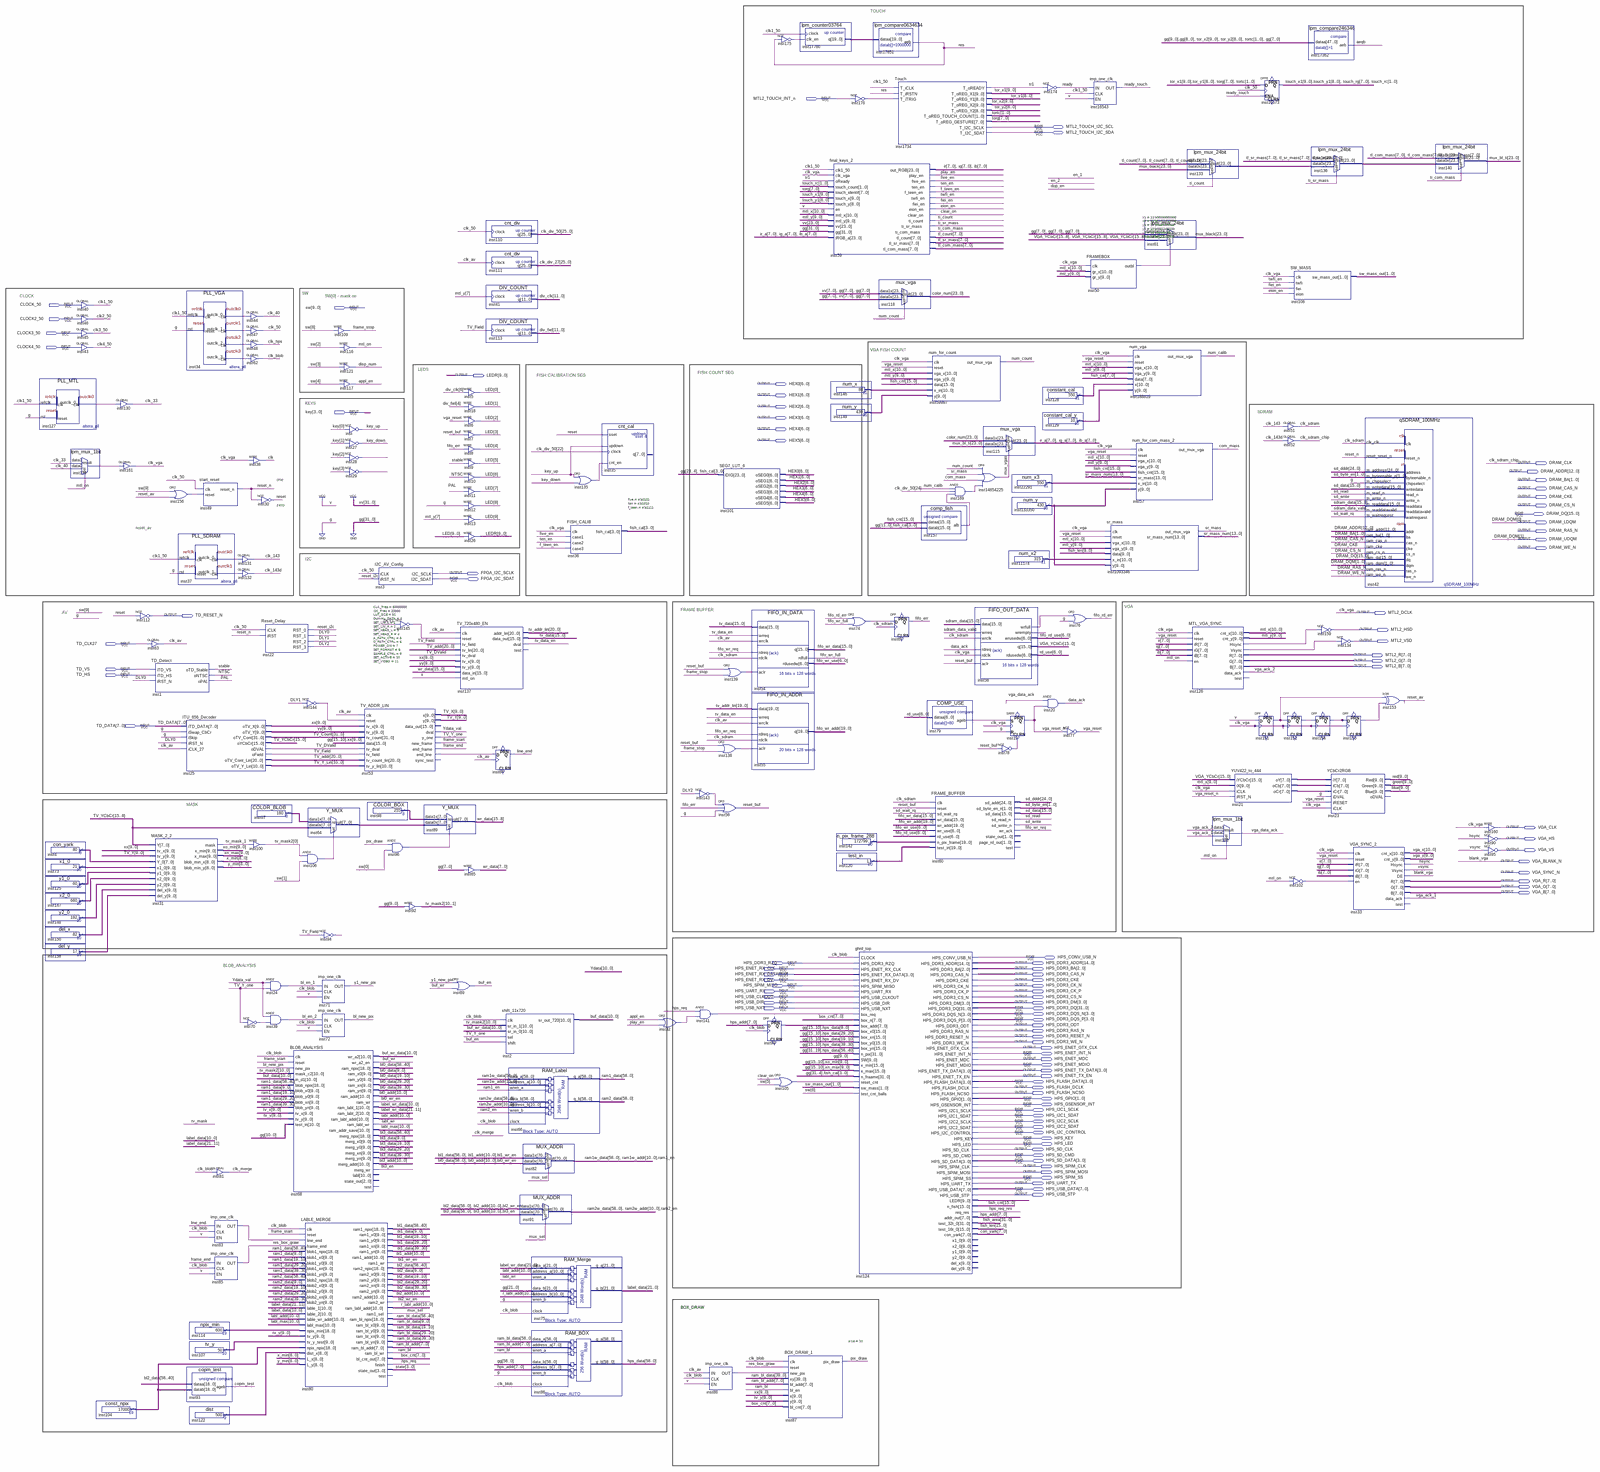
[diagram p0: schematic sheet, whole]
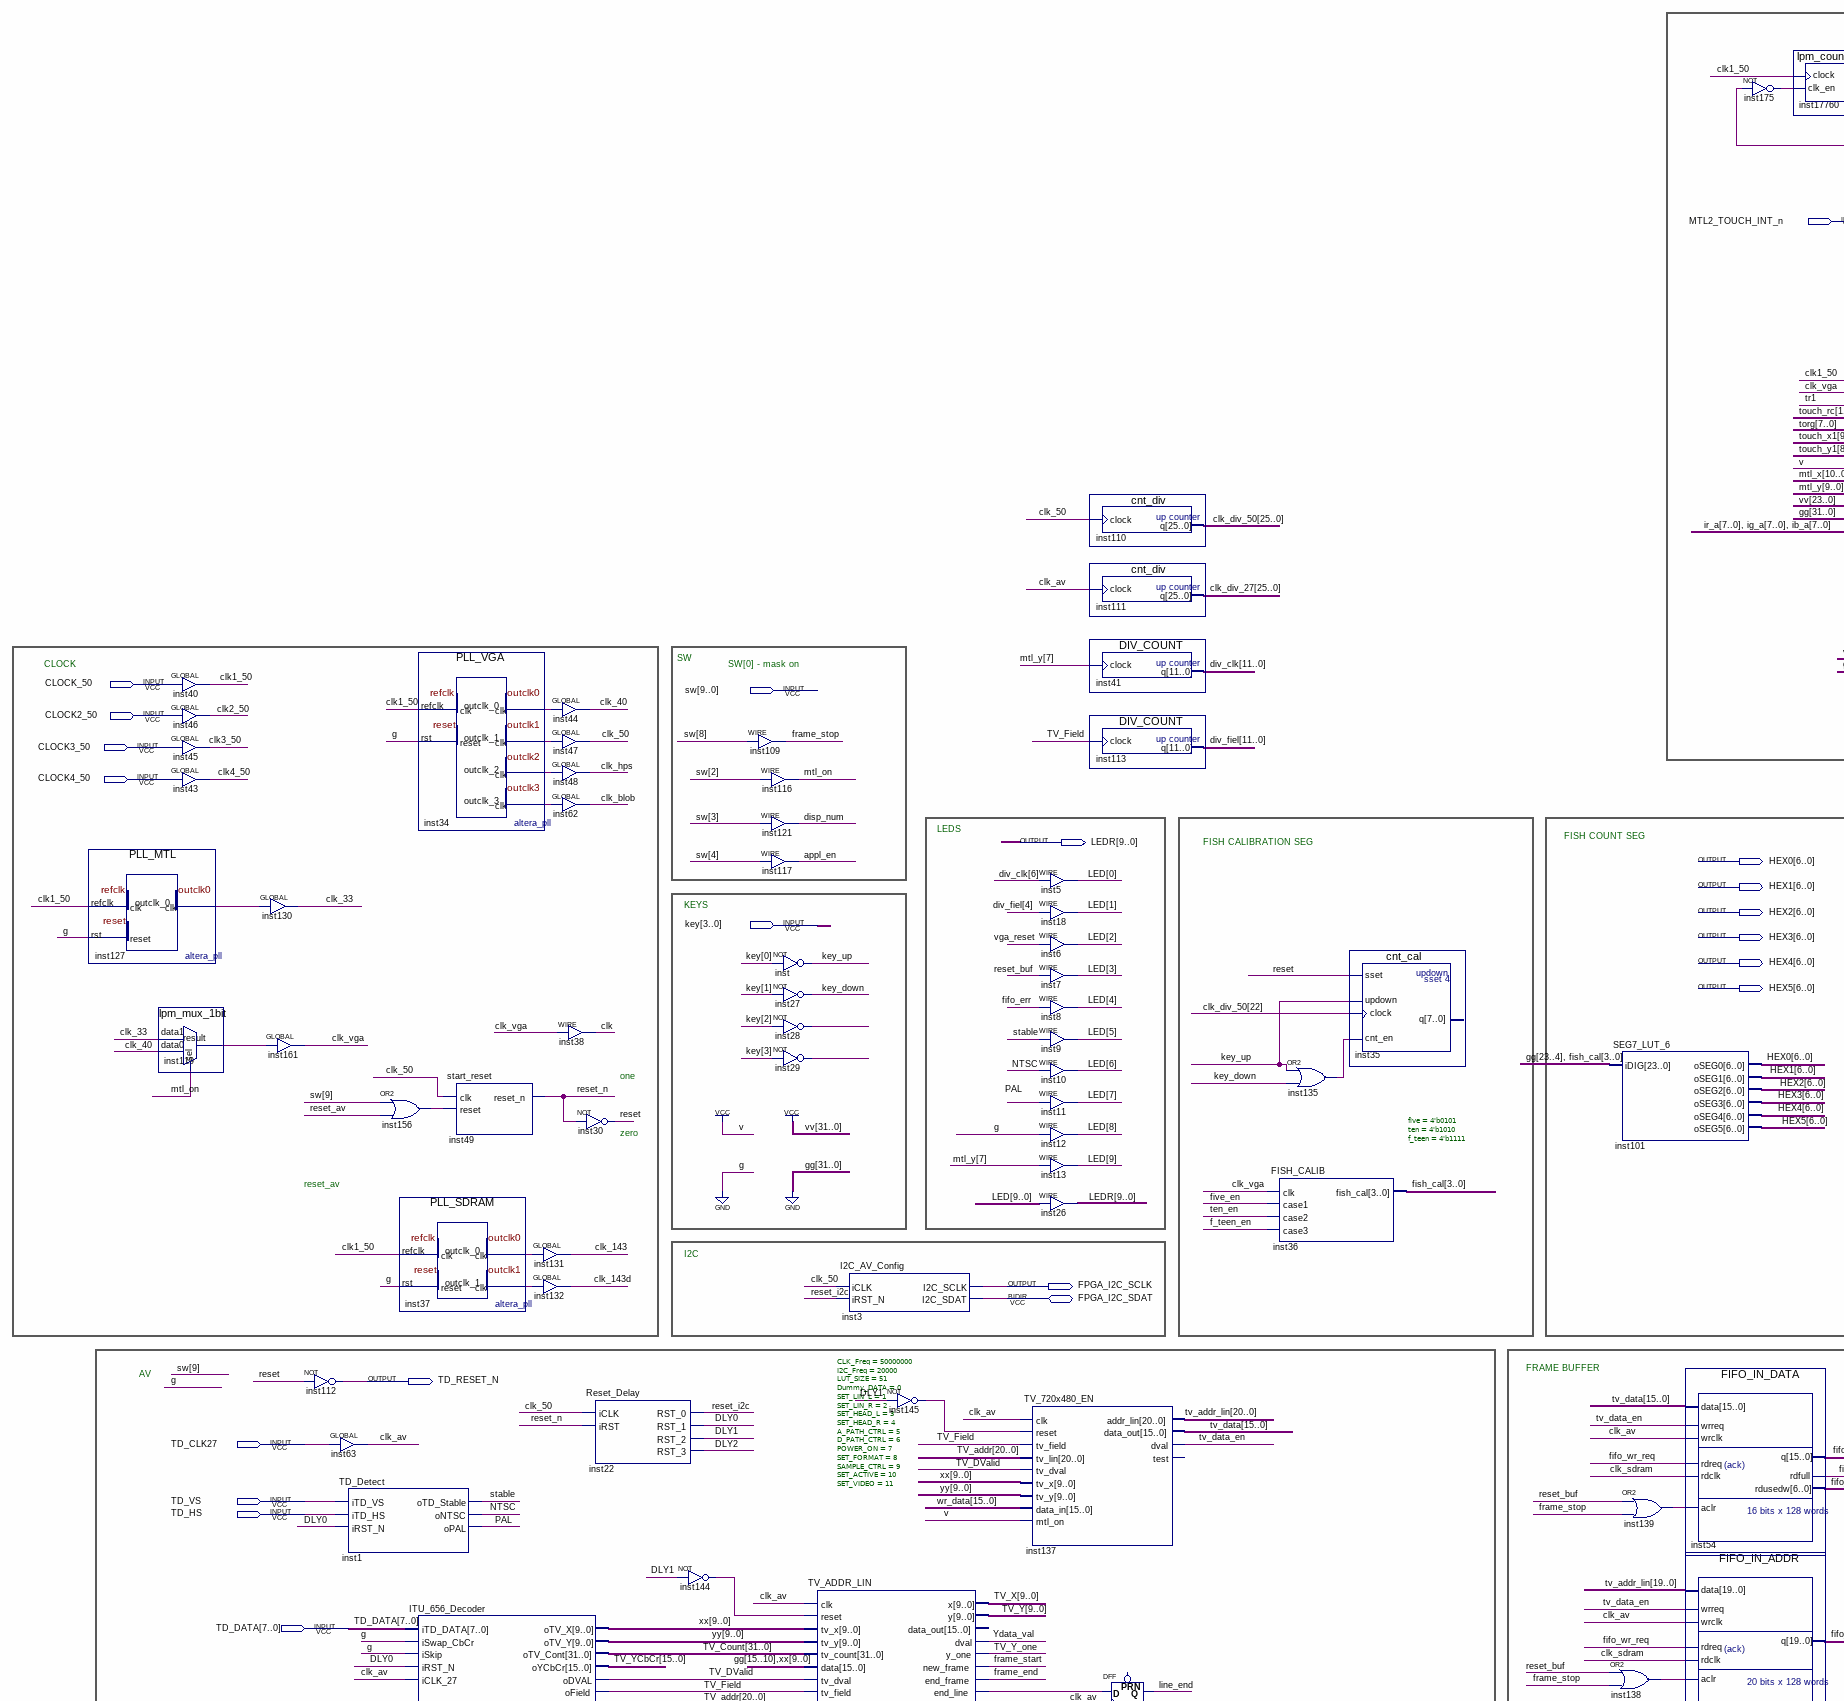
[diagram p1: schematic sheet, upper left part]
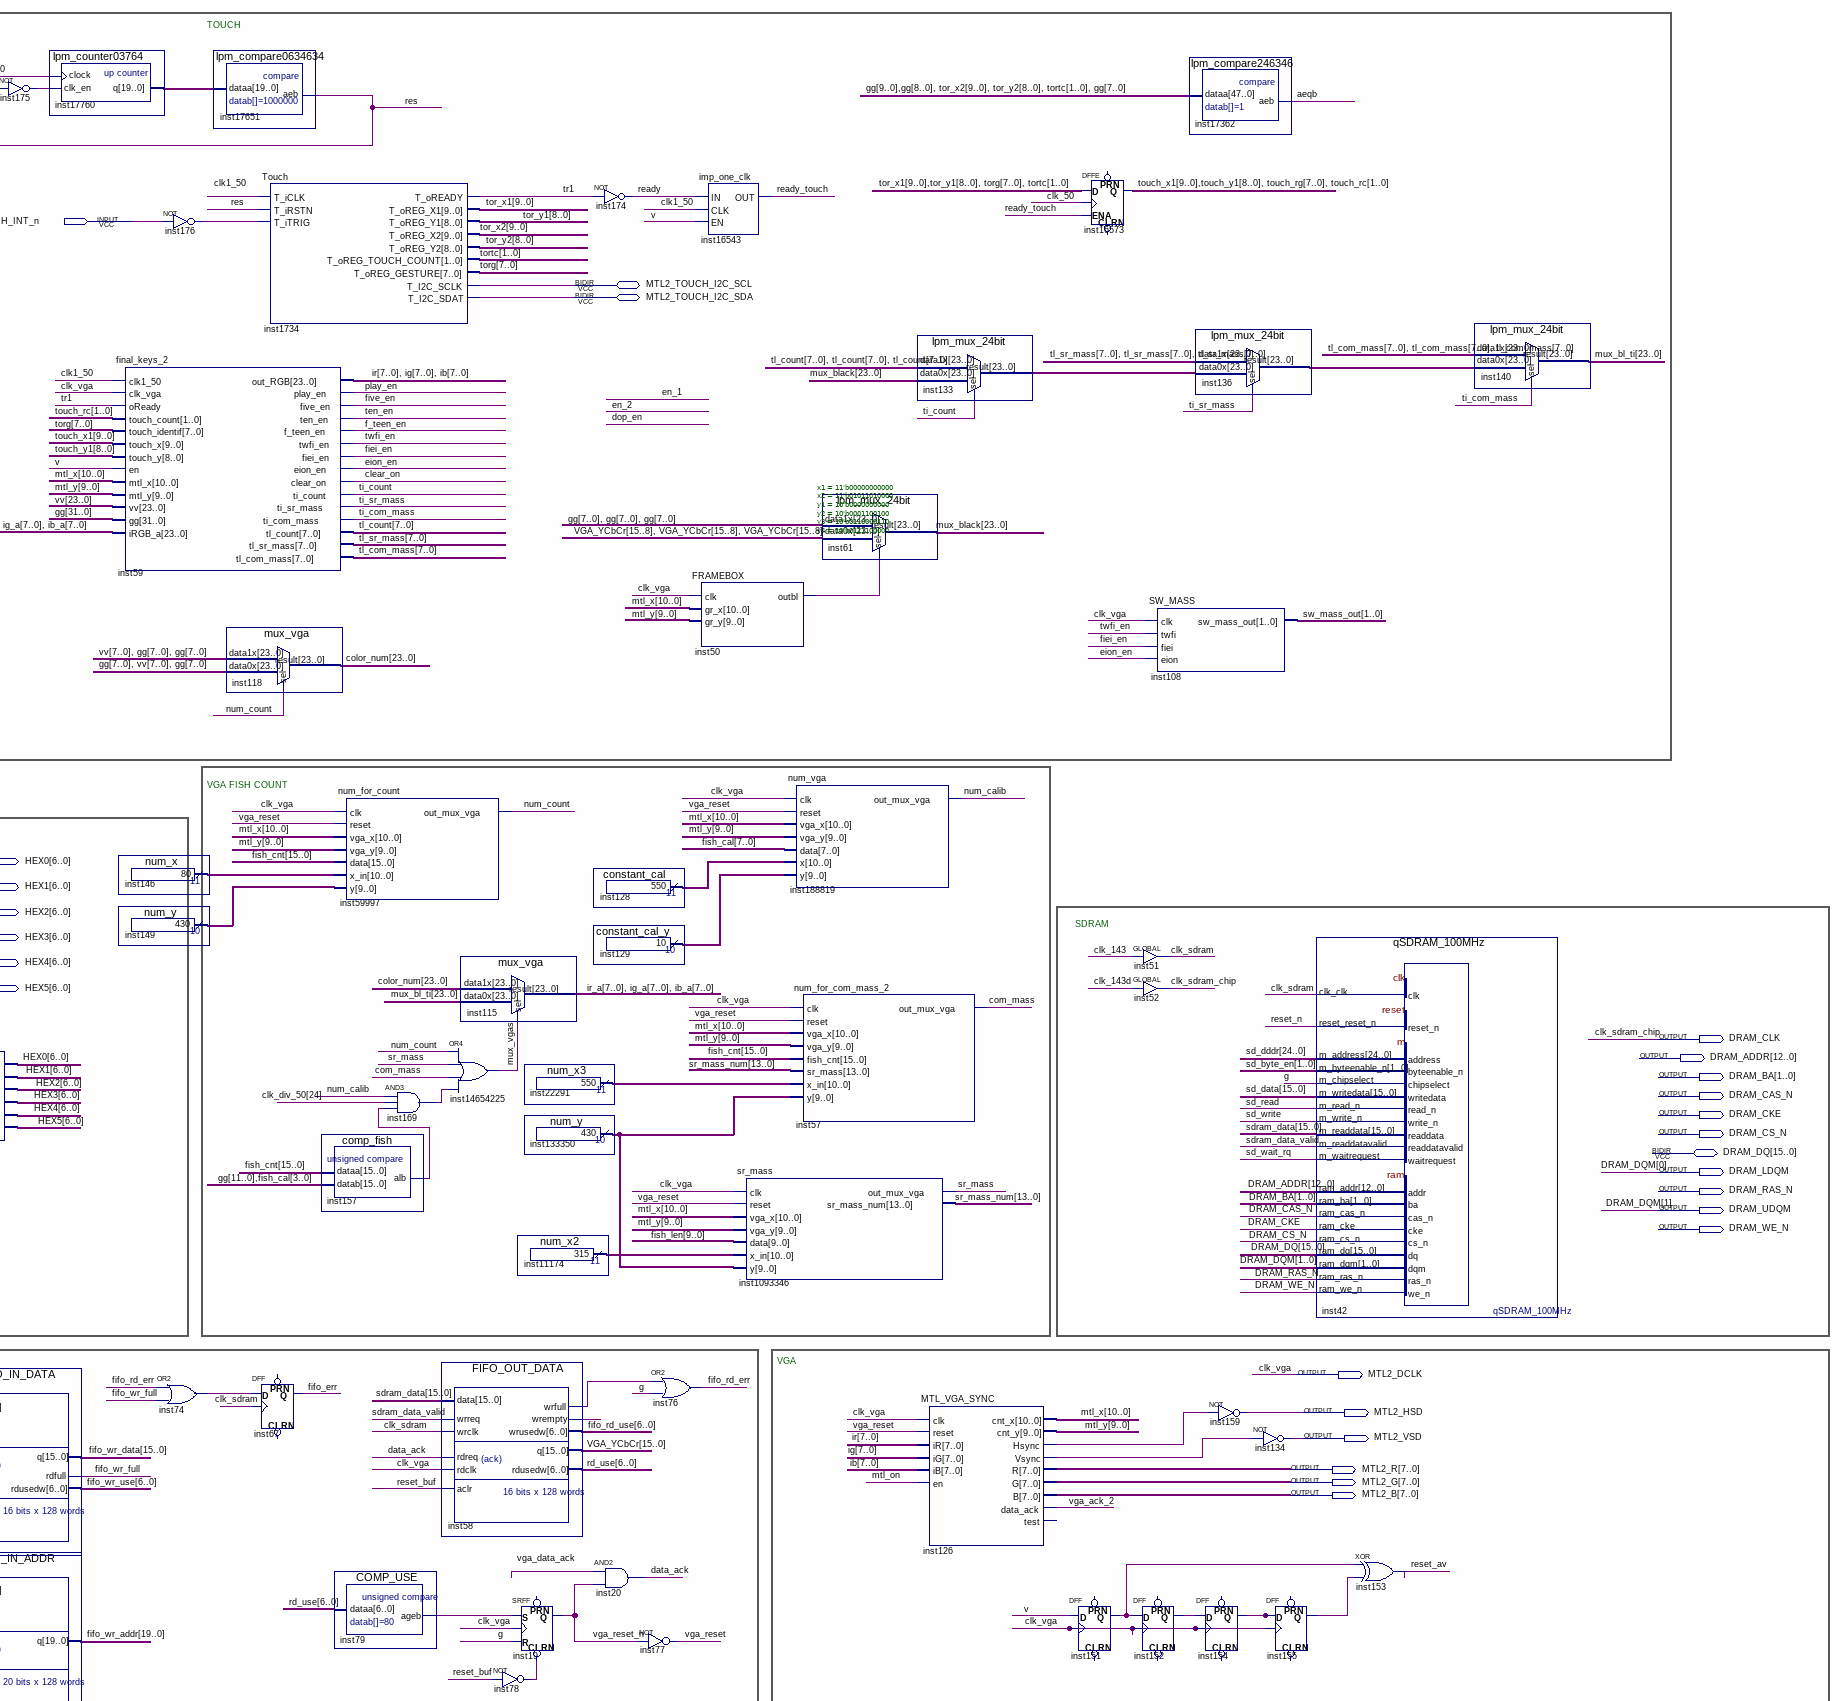
[diagram p2: schematic sheet, upper right part]
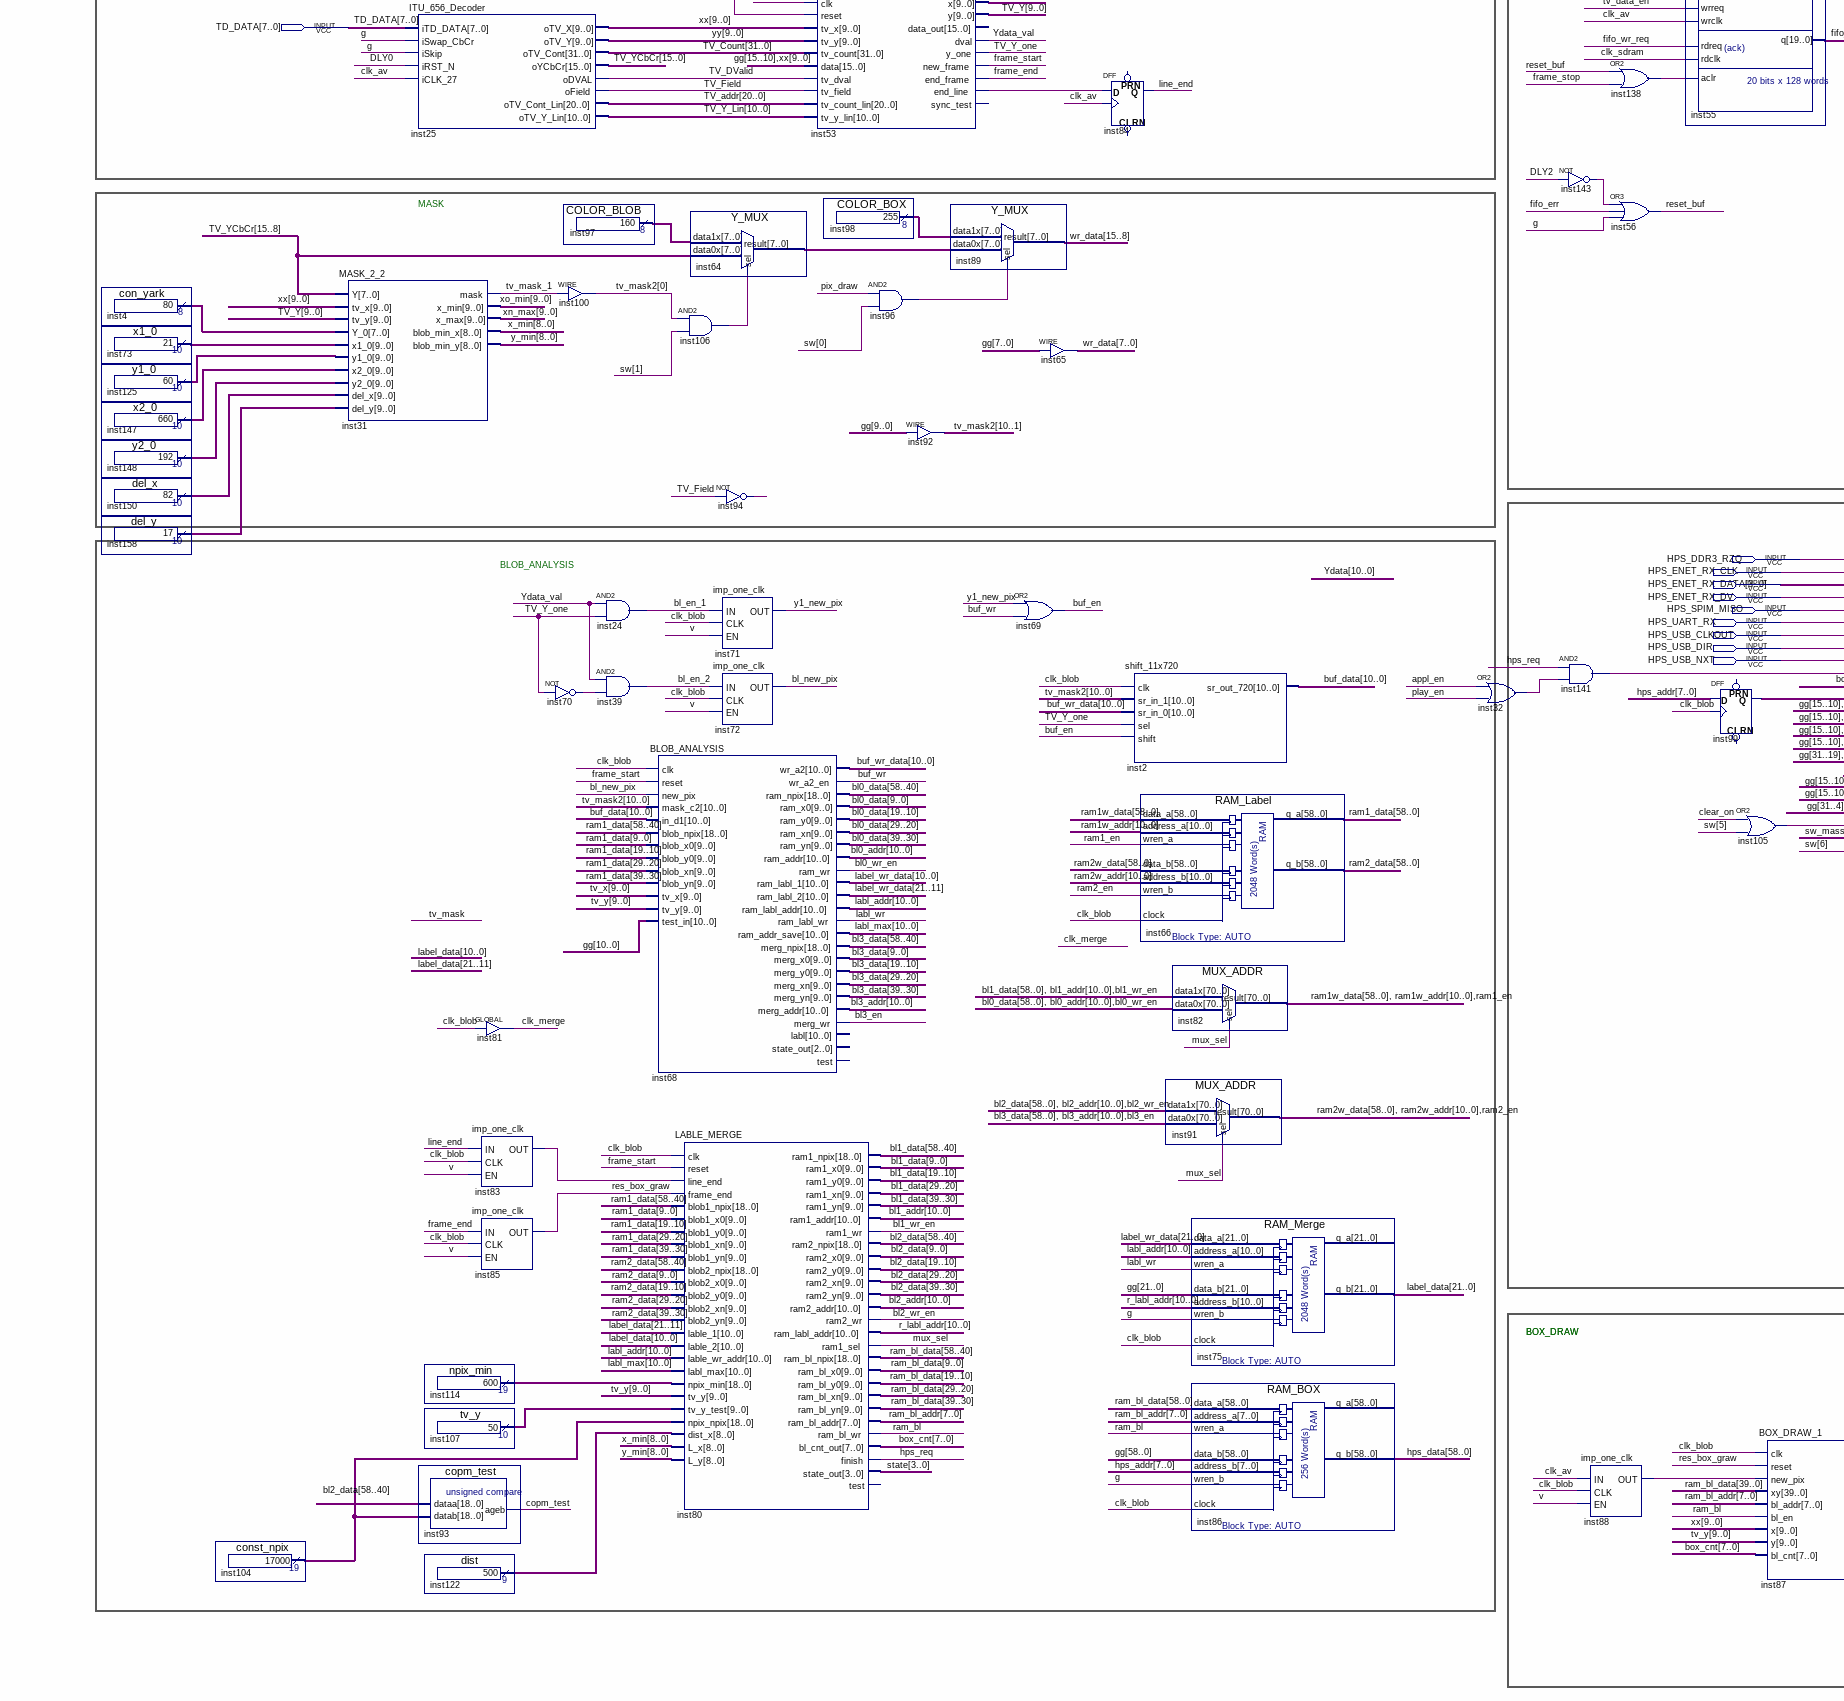
[diagram p3: schematic sheet, lower left part]
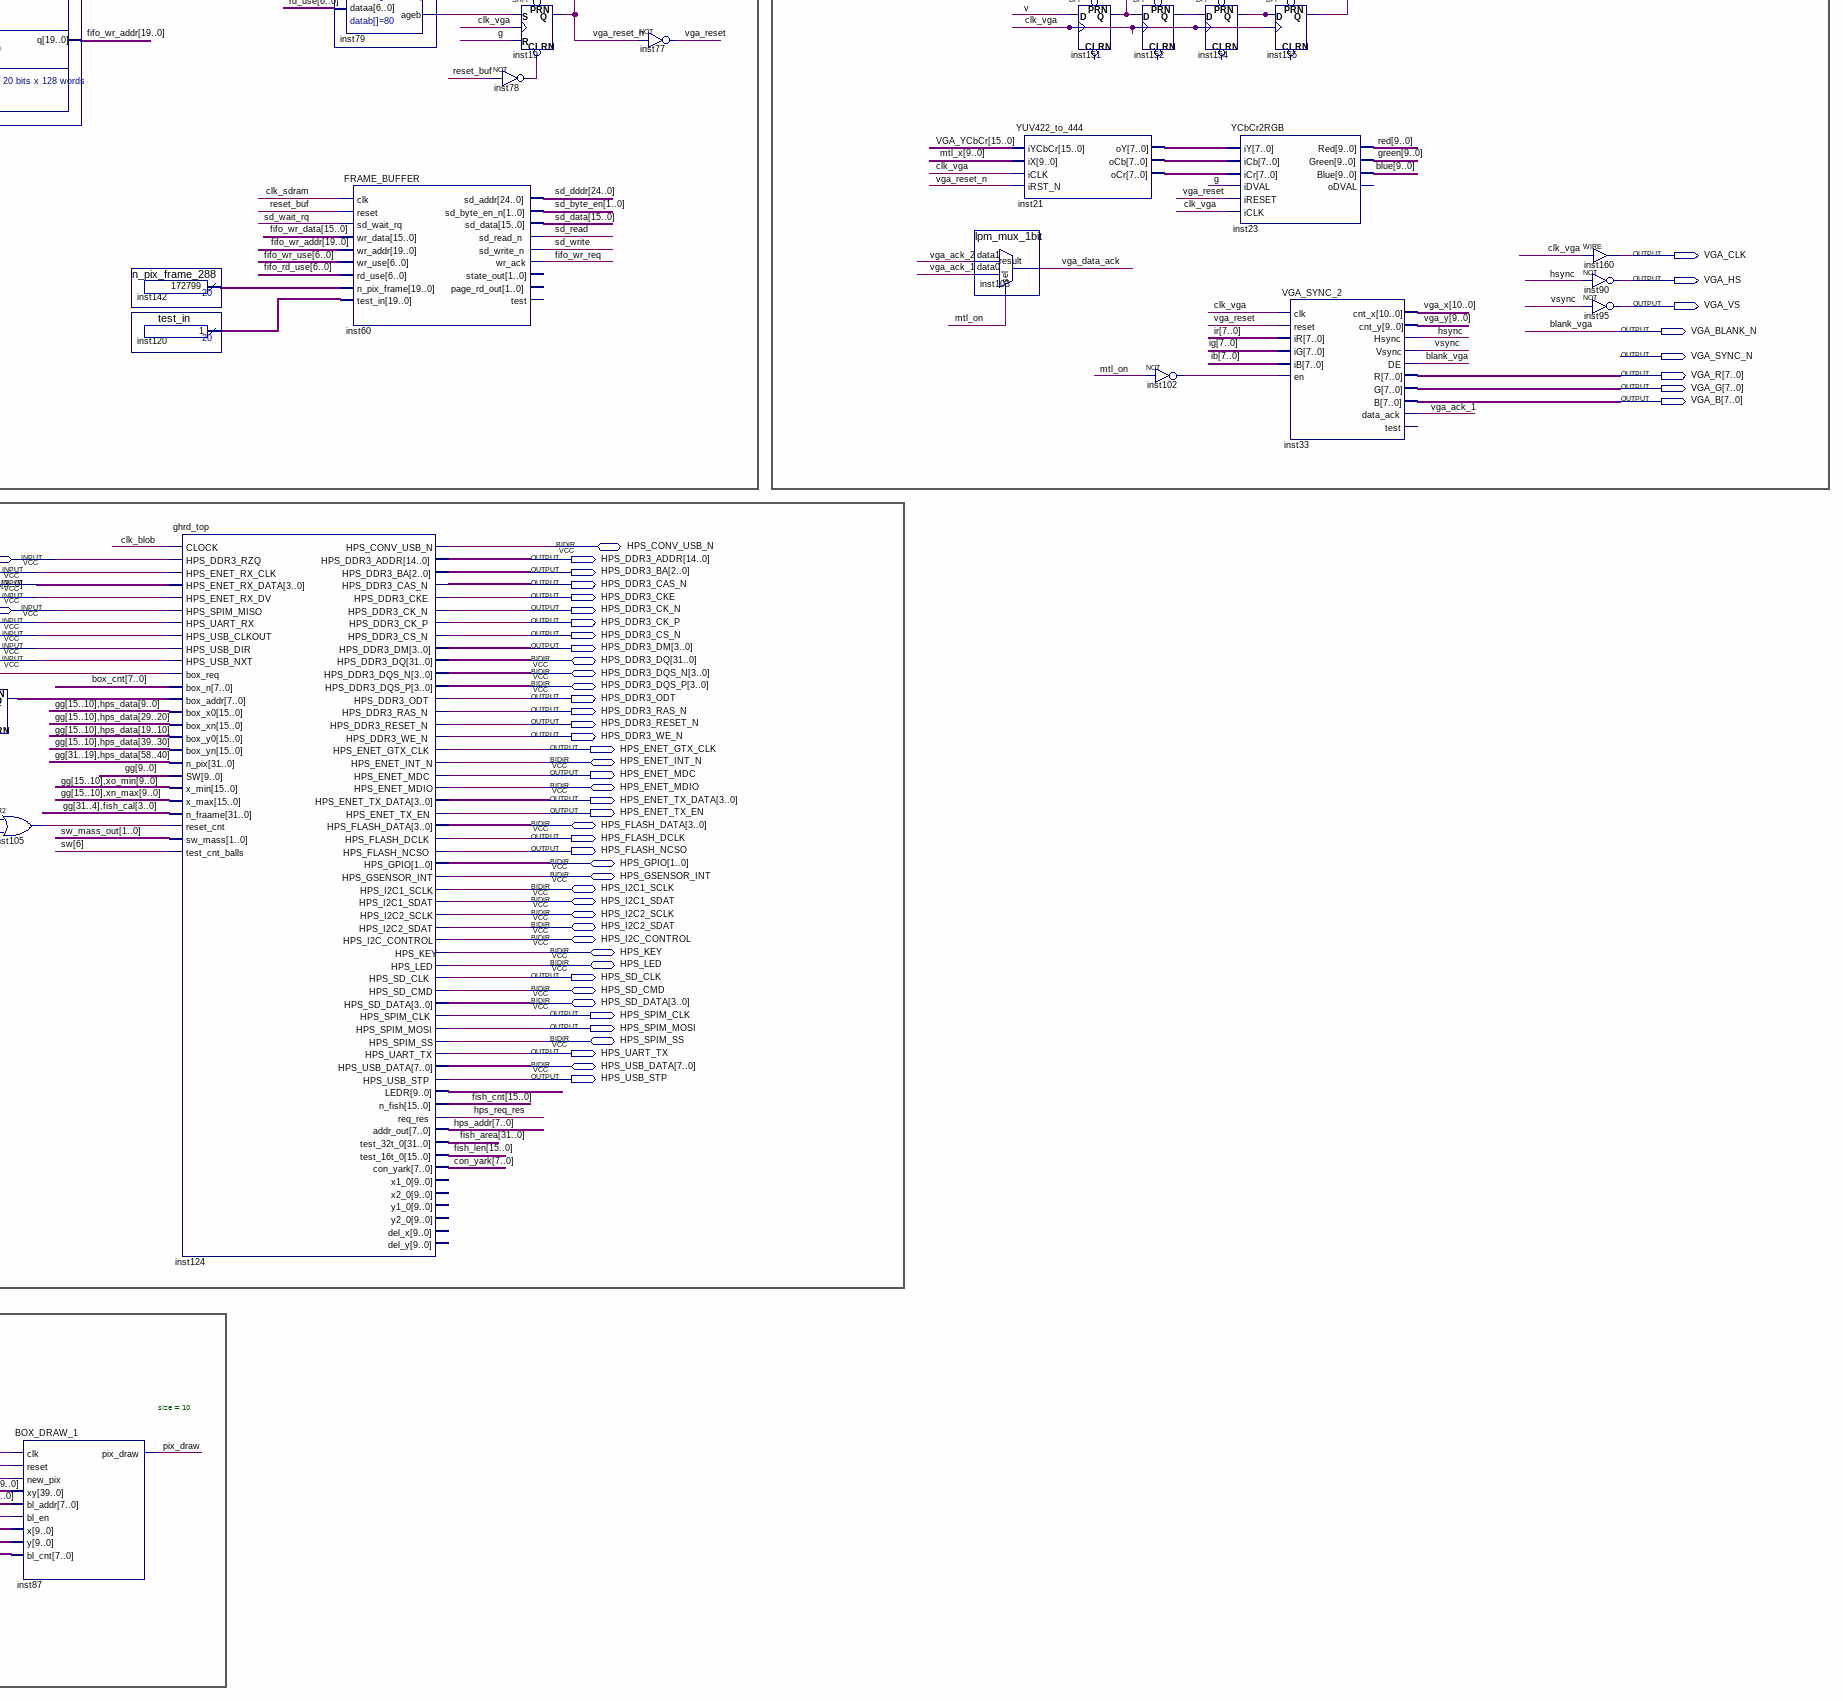
[diagram p4: schematic sheet, lower right part]
// Quartus schematic DE1_SOC_SHEM_2.bdf as structural Verilog: 174 symbols, 100 pins
module DE1_SOC_SHEM_2 (
  input  MTL2_TOUCH_INT_n,
  input  CLOCK_50,
  input  [9:0] sw,
  input  CLOCK2_50,
  input  CLOCK3_50,
  input  CLOCK4_50,
  input  [3:0] key,
  input  TD_CLK27,
  input  TD_VS,
  input  TD_HS,
  input  [7:0] TD_DATA,
  input  HPS_DDR3_RZQ,
  input  HPS_ENET_RX_CLK,
  input  [3:0] HPS_ENET_RX_DATA,
  input  HPS_ENET_RX_DV,
  input  HPS_SPIM_MISO,
  input  HPS_UART_RX,
  input  HPS_USB_CLKOUT,
  input  HPS_USB_DIR,
  input  HPS_USB_NXT,
  inout  MTL2_TOUCH_I2C_SCL,
  inout  MTL2_TOUCH_I2C_SDA,
  inout  [15:0] DRAM_DQ,
  inout  FPGA_I2C_SDAT,
  inout  HPS_CONV_USB_N,
  inout  [31:0] HPS_DDR3_DQ,
  inout  [3:0] HPS_DDR3_DQS_N,
  inout  [3:0] HPS_DDR3_DQS_P,
  inout  HPS_ENET_INT_N,
  inout  HPS_ENET_MDIO,
  inout  [3:0] HPS_FLASH_DATA,
  inout  [1:0] HPS_GPIO,
  inout  HPS_GSENSOR_INT,
  inout  HPS_I2C1_SCLK,
  inout  HPS_I2C1_SDAT,
  inout  HPS_I2C2_SCLK,
  inout  HPS_I2C2_SDAT,
  inout  HPS_I2C_CONTROL,
  inout  HPS_KEY,
  inout  HPS_LED,
  inout  HPS_SD_CMD,
  inout  [3:0] HPS_SD_DATA,
  inout  HPS_SPIM_SS,
  inout  [7:0] HPS_USB_DATA,
  output [9:0] LEDR,
  output [6:0] HEX0,
  output [6:0] HEX1,
  output [6:0] HEX2,
  output [6:0] HEX3,
  output [6:0] HEX4,
  output [6:0] HEX5,
  output DRAM_CLK,
  output [12:0] DRAM_ADDR,
  output [1:0] DRAM_BA,
  output DRAM_CAS_N,
  output DRAM_CKE,
  output DRAM_CS_N,
  output DRAM_LDQM,
  output DRAM_RAS_N,
  output DRAM_UDQM,
  output DRAM_WE_N,
  output FPGA_I2C_SCLK,
  output MTL2_DCLK,
  output TD_RESET_N,
  output MTL2_HSD,
  output MTL2_VSD,
  output [7:0] MTL2_R,
  output [7:0] MTL2_G,
  output [7:0] MTL2_B,
  output VGA_CLK,
  output VGA_HS,
  output VGA_VS,
  output VGA_BLANK_N,
  output VGA_SYNC_N,
  output [7:0] VGA_R,
  output [7:0] VGA_G,
  output [7:0] VGA_B,
  output [14:0] HPS_DDR3_ADDR,
  output [2:0] HPS_DDR3_BA,
  output HPS_DDR3_CAS_N,
  output HPS_DDR3_CKE,
  output HPS_DDR3_CK_N,
  output HPS_DDR3_CK_P,
  output HPS_DDR3_CS_N,
  output [3:0] HPS_DDR3_DM,
  output HPS_DDR3_ODT,
  output HPS_DDR3_RAS_N,
  output HPS_DDR3_RESET_N,
  output HPS_DDR3_WE_N,
  output HPS_ENET_GTX_CLK,
  output HPS_ENET_MDC,
  output [3:0] HPS_ENET_TX_DATA,
  output HPS_ENET_TX_EN,
  output HPS_FLASH_DCLK,
  output HPS_FLASH_NCSO,
  output HPS_SD_CLK,
  output HPS_SPIM_CLK,
  output HPS_SPIM_MOSI,
  output HPS_UART_TX,
  output HPS_USB_STP
);

  wire aeqb, appl_en, bl0_wr_en, bl1_wr_en, bl2_wr_en, bl3_en, bl_en_1, bl_en_2, bl_new_pix, buf_en, buf_wr,
       clear_on, clk, clk1_50, clk2_50, clk3_50, clk4_50, clk_33, clk_40, clk_50, clk_143, clk_143d, clk_av,
       clk_blob, clk_hps, clk_merge, clk_sdram, com_mass, copm_test, data_ack, disp_num, DLY0, DLY1, DLY2,
       eion_en, f_teen_en, fiei_en, fifo_err, fifo_rd_err, fifo_wr_full, fifo_wr_req, five_en, frame_end,
       frame_start, frame_stop, hps_req, hps_req_res, hsync, inst28_out, inst29_out, inst32_out,
       inst34_outclk_0, inst34_outclk_1, inst34_outclk_2, inst34_outclk_3, inst37_outclk_0, inst37_outclk_1,
       inst50_outbl, inst53_end_line, inst58_wrempty, inst58_wrfull, inst70_out, inst74_out, inst78_out,
       inst79_ageb, inst83_out, inst88_out, inst94_out, inst96_out, inst102_out, inst105_out, inst106_out,
       inst119_result, inst126_hsync, inst126_vsync, inst127_outclk_0, inst135_out, inst138_out, inst139_out,
       inst141_out, inst143_out, inst144_out, inst145_out, inst151_q, inst152_q, inst154_q, inst155_q,
       inst156_out, inst157_alb, inst169_out, inst175_out, inst176_out, key_down, key_up, labl_wr, line_end,
       mtl_on, mux_sel, mux_vgas, NTSC, num_calib, num_count, PAL, pix_draw, play_en, ram1_en, ram2_en,
       ram_bl, ready, ready_touch, res, res_box_graw, reset, reset_av, reset_buf, reset_i2c, reset_n,
       sd_read, sd_wait_rq, sd_write, sdram_data_valid, sr_mass, stable, ten_en, ti_com_mass, ti_count,
       ti_sr_mass, tr1, tv_data_en, TV_DValid, TV_Field, tv_mask_1, TV_Y_one, twfi_en, vga_ack_1, vga_ack_2,
       vga_data_ack, vga_reset, vga_reset_n, vsync, y1_new_pix, Ydata_val;
  wire [1:0] sd_byte_en, sw_mass_out, tortc, touch_rc;
  wire [3:0] state;
  wire [6:0] fifo_rd_use, fifo_wr_use, rd_use;
  wire [7:0] box_cnt, con_yark, fish_cal, hps_addr, ib, ib_a, ig, ig_a, inst4_result, inst21_ocb, inst21_ocr,
       inst21_oy, inst64_result, inst97_result, inst98_result, inst99_q, ir, ir_a, ram_bl_addr, tl_com_mass,
       tl_count, tl_sr_mass, torg, touch_rg;
  wire [8:0] inst122_result, tor_y1, tor_y2, touch_y1, x_min, y_min;
  wire [9:0] blue, green, inst73_result, inst107_result, inst124_ledr, inst125_result, inst129_result,
       inst147_result, inst148_result, inst149_result, inst150_result, inst158_result, inst133350_result,
       LED, mtl_y, red, tor_x1, tor_x2, touch_x1, TV_X, tv_y, vga_y, xn_max, xo_min, xx, yy;
  wire [10:0] bl0_addr, bl1_addr, bl2_addr, bl3_addr, buf_data, buf_wr_data, inst128_result, inst146_result,
       inst11174_result, inst22291_result, labl_addr, labl_max, mtl_x, r_labl_addr, ram1w_addr, ram2w_addr,
       tv_mask2, TV_Y_Lin, vga_x;
  wire [11:0] div_clk, div_fiel;
  wire [13:0] sr_mass_num;
  wire [15:0] fifo_wr_data, fish_cnt, fish_len, sd_data, sdram_data, tv_data, TV_YCbCr, VGA_YCbCr, wr_data;
  wire [18:0] inst104_result, inst114_result;
  wire [19:0] fifo_wr_addr, inst120_result, inst142_result, inst17760_q;
  wire [20:0] TV_addr, tv_addr_lin;
  wire [21:0] label_data, label_wr_data;
  wire [23:0] color_num, inst133_result, inst136_result, mux_bl_ti, mux_black;
  wire [24:0] sd_dddr;
  wire [25:0] clk_div_27, clk_div_50;
  wire [31:0] fish_area, TV_Count;
  wire [58:0] bl0_data, bl1_data, bl2_data, bl3_data, hps_data, ram1_data, ram1w_data, ram2_data, ram2w_data,
       ram_bl_data;
  wire [58:32] gg;

  PLL_MTL inst127 (.refclk(clk1_50), .rst(1'b0), .outclk_0(inst127_outclk_0));
  con_yark inst4 (.result(inst4_result));
  x1_0 inst73 (.result(inst73_result));
  y1_0 inst125 (.result(inst125_result));
  x2_0 inst147 (.result(inst147_result));
  y2_0 inst148 (.result(inst148_result));
  del_x inst150 (.result(inst150_result));
  del_y inst158 (.result(inst158_result));
  GLOBAL inst40 (.IN(CLOCK_50), .OUT(clk1_50));
  GLOBAL inst46 (.IN(CLOCK2_50), .OUT(clk2_50));
  GLOBAL inst45 (.IN(CLOCK3_50), .OUT(clk3_50));
  GLOBAL inst43 (.IN(CLOCK4_50), .OUT(clk4_50));
  lpm_mux_1bit inst119 (.data1(clk_33), .data0(clk_40), .sel(mtl_on), .result(inst119_result));
  const_npix inst104 (.result(inst104_result));
  GLOBAL inst130 (.IN(inst127_outclk_0), .OUT(clk_33));
  GLOBAL inst161 (.IN(inst119_result), .OUT(MTL2_DCLK));
  not inst112 (TD_RESET_N, reset);
  GLOBAL inst63 (.IN(TD_CLK27), .OUT(clk_av));
  or inst156 (inst156_out, sw[9], reset_av);
  TD_Detect inst1 (.iTD_VS(TD_VS), .iTD_HS(TD_HS), .iRST_N(DLY0), .oTD_Stable(stable), .oNTSC(NTSC), .oPAL(PAL));
  MASK_2_2 inst31 (
    .Y(TV_YCbCr[15:8]), .tv_x(xx), .tv_y(tv_y), .Y_0(inst4_result), .x1_0(inst73_result),
    .y1_0(inst125_result), .x2_0(inst147_result), .y2_0(inst148_result), .del_x(inst150_result),
    .del_y(inst158_result), .mask(tv_mask_1), .x_min(xo_min), .x_max(xn_max), .blob_min_x(x_min),
    .blob_min_y(y_min));
  PLL_VGA inst34 (
    .refclk(clk1_50), .rst(1'b0), .outclk_0(inst34_outclk_0), .outclk_1(inst34_outclk_1),
    .outclk_2(inst34_outclk_2), .outclk_3(inst34_outclk_3));
  PLL_SDRAM inst37 (.refclk(clk1_50), .rst(1'b0), .outclk_0(inst37_outclk_0), .outclk_1(inst37_outclk_1));
  ITU_656_Decoder inst25 (
    .iTD_DATA(TD_DATA), .iSwap_CbCr(1'b0), .iSkip(1'b0), .iRST_N(DLY0), .iCLK_27(clk_av), .oTV_X(xx),
    .oTV_Y(yy), .oTV_Cont(TV_Count), .oYCbCr(TV_YCbCr), .oDVAL(TV_DValid), .oField(TV_Field),
    .oTV_Cont_Lin(TV_addr), .oTV_Y_Lin(TV_Y_Lin));
  npix_min inst114 (.result(inst114_result));
  tv_y inst107 (.result(inst107_result));
  copm_test inst93 (.dataa(bl2_data[58:40]), .datab(inst104_result), .ageb(copm_test));
  \dist  inst122 (.result(inst122_result));
  start_reset inst49 (.clk(clk_50), .reset(inst156_out), .reset_n(reset_n));
  GLOBAL inst81 (.IN(clk_blob), .OUT(clk_merge));
  imp_one_clk inst83 (.IN(line_end), .CLK(clk_blob), .EN(1'b1), .OUT(inst83_out));
  imp_one_clk inst85 (.IN(frame_end), .CLK(clk_blob), .EN(1'b1), .OUT(res_box_graw));
  GLOBAL inst131 (.IN(inst37_outclk_0), .OUT(clk_143));
  GLOBAL inst132 (.IN(inst37_outclk_1), .OUT(clk_143d));
  GLOBAL inst44 (.IN(inst34_outclk_0), .OUT(clk_40));
  GLOBAL inst47 (.IN(inst34_outclk_1), .OUT(clk_50));
  GLOBAL inst48 (.IN(inst34_outclk_2), .OUT(clk_hps));
  GLOBAL inst62 (.IN(inst34_outclk_3), .OUT(clk_blob));
  assign clk = MTL2_DCLK;  // WIRE inst38
  not inst30 (reset, reset_n);
  Reset_Delay inst22 (.iCLK(clk_50), .iRST(reset_n), .RST_0(reset_i2c), .RST_1(DLY0), .RST_2(DLY1), .RST_3(DLY2));
  COLOR_BLOB inst97 (.result(inst97_result));
  assign tv_mask2[0] = tv_mask_1;  // WIRE inst100
  not inst70 (inst70_out, TV_Y_one);
  and inst24 (bl_en_1, Ydata_val, TV_Y_one);
  and inst39 (bl_en_2, Ydata_val, inst70_out);
  not inst144 (inst144_out, DLY1);
  and inst106 (inst106_out, tv_mask2[0], sw[1]);
  BLOB_ANALYSIS inst68 (
    .clk(clk_blob), .reset(frame_start), .new_pix(bl_new_pix), .mask_c2(tv_mask2), .in_d1(buf_data),
    .blob_npix(ram1_data[58:40]), .blob_x0(ram1_data[9:0]), .blob_y0(ram1_data[19:10]),
    .blob_xn(ram1_data[29:20]), .blob_yn(ram1_data[39:30]), .tv_x(TV_X), .tv_y(tv_y), .test_in({11{1'b0}}),
    .wr_a2(buf_wr_data), .wr_a2_en(buf_wr), .ram_npix(bl0_data[58:40]), .ram_x0(bl0_data[9:0]),
    .ram_y0(bl0_data[19:10]), .ram_xn(bl0_data[29:20]), .ram_yn(bl0_data[39:30]), .ram_addr(bl0_addr),
    .ram_wr(bl0_wr_en), .ram_labl_1(label_wr_data[10:0]), .ram_labl_2(label_wr_data[21:11]),
    .ram_labl_addr(labl_addr), .ram_labl_wr(labl_wr), .ram_addr_save(labl_max), .merg_npix(bl3_data[58:40]),
    .merg_x0(bl3_data[9:0]), .merg_y0(bl3_data[19:10]), .merg_xn(bl3_data[29:20]), .merg_yn(bl3_data[39:30]),
    .merg_addr(bl3_addr), .merg_wr(bl3_en));  // open: labl, state_out, test
  LABLE_MERGE inst80 (
    .clk(clk_blob), .reset(frame_start), .line_end(inst83_out), .frame_end(res_box_graw),
    .blob1_npix(ram1_data[58:40]), .blob1_x0(ram1_data[9:0]), .blob1_y0(ram1_data[19:10]),
    .blob1_xn(ram1_data[29:20]), .blob1_yn(ram1_data[39:30]), .blob2_npix(ram2_data[58:40]),
    .blob2_x0(ram2_data[9:0]), .blob2_y0(ram2_data[19:10]), .blob2_xn(ram2_data[29:20]),
    .blob2_yn(ram2_data[39:30]), .lable_1(label_data[21:11]), .lable_2(label_data[10:0]),
    .lable_wr_addr(labl_addr), .labl_max(labl_max), .npix_min(inst114_result), .tv_y(tv_y),
    .tv_y_test(inst107_result), .npix_npix(inst104_result), .dist_x(inst122_result), .L_x(x_min),
    .L_y(y_min), .ram1_npix(bl1_data[58:40]), .ram1_x0(bl1_data[9:0]), .ram1_y0(bl1_data[19:10]),
    .ram1_xn(bl1_data[29:20]), .ram1_yn(bl1_data[39:30]), .ram1_addr(bl1_addr), .ram1_wr(bl1_wr_en),
    .ram2_npix(bl2_data[58:40]), .ram2_x0(bl2_data[9:0]), .ram2_y0(bl2_data[19:10]),
    .ram2_xn(bl2_data[29:20]), .ram2_yn(bl2_data[39:30]), .ram2_addr(bl2_addr), .ram2_wr(bl2_wr_en),
    .ram_labl_addr(r_labl_addr), .ram1_sel(mux_sel), .ram_bl_npix(ram_bl_data[58:40]),
    .ram_bl_x0(ram_bl_data[9:0]), .ram_bl_y0(ram_bl_data[19:10]), .ram_bl_xn(ram_bl_data[29:20]),
    .ram_bl_yn(ram_bl_data[39:30]), .ram_bl_addr(ram_bl_addr), .ram_bl_wr(ram_bl), .bl_cnt_out(box_cnt),
    .finish(hps_req), .state_out(state));  // open: test
  Y_MUX inst64 (.data1x(inst97_result), .data0x(TV_YCbCr[15:8]), .sel(inst106_out), .result(inst64_result));
  not inst94 (inst94_out, TV_Field);
  imp_one_clk inst71 (.IN(bl_en_1), .CLK(clk_blob), .EN(1'b1), .OUT(y1_new_pix));
  imp_one_clk inst72 (.IN(bl_en_2), .CLK(clk_blob), .EN(1'b1), .OUT(bl_new_pix));
  assign frame_stop = sw[8];  // WIRE inst109
  assign mtl_on = sw[2];  // WIRE inst116
  assign disp_num = sw[3];  // WIRE inst121
  assign appl_en = sw[4];  // WIRE inst117
  not inst (key_up, key[0]);
  not inst27 (key_down, key[1]);
  not inst28 (inst28_out, key[2]);
  not inst29 (inst29_out, key[3]);
  I2C_AV_Config #(.CLK_Freq(50000000), .I2C_Freq(20000), .LUT_SIZE(51), .Dummy_DATA(0), .SET_LIN_L(1), .SET_LIN_R(2), .SET_HEAD_L(3), .SET_HEAD_R(4), .A_PATH_CTRL(5), .D_PATH_CTRL(6), .POWER_ON(7), .SET_FORMAT(8), .SAMPLE_CTRL(9), .SET_ACTIVE(10), .SET_VIDEO(11)) inst3 (
    .iCLK(clk_50), .iRST_N(reset_i2c), .I2C_SCLK(FPGA_I2C_SCLK), .I2C_SDAT(FPGA_I2C_SDAT));
  TV_ADDR_LIN inst53 (
    .clk(clk_av), .reset(inst144_out), .tv_x(xx), .tv_y(yy), .tv_count(TV_Count), .data({{6{1'b0}}, xx}),
    .tv_dval(TV_DValid), .tv_field(TV_Field), .tv_count_lin(TV_addr), .tv_y_lin(TV_Y_Lin), .x(TV_X),
    .y(tv_y), .dval(Ydata_val), .y_one(TV_Y_one), .new_frame(frame_start), .end_frame(frame_end),
    .end_line(inst53_end_line));  // open: data_out, sync_test
  COLOR_BOX inst98 (.result(inst98_result));
  not inst145 (inst145_out, DLY1);
  and inst96 (inst96_out, pix_draw, sw[0]);
  assign tv_mask2[10:1] = {10{1'b0}};  // WIRE inst92
  Y_MUX inst89 (.data1x(inst98_result), .data0x(inst64_result), .sel(inst96_out), .result(wr_data[15:8]));
  assign LED[0] = div_clk[6];  // WIRE inst5
  assign LED[1] = div_fiel[4];  // WIRE inst18
  assign LED[2] = vga_reset;  // WIRE inst6
  assign LED[3] = reset_buf;  // WIRE inst7
  assign LED[4] = fifo_err;  // WIRE inst8
  assign LED[5] = stable;  // WIRE inst9
  assign LED[6] = NTSC;  // WIRE inst10
  assign LED[7] = PAL;  // WIRE inst11
  assign LED[8] = 1'b0;  // WIRE inst12
  assign LED[9] = mtl_y[7];  // WIRE inst13
  assign LEDR = LED;  // WIRE inst26
  TV_720x480_EN inst137 (
    .clk(clk_av), .reset(inst145_out), .tv_field(TV_Field), .tv_lin(TV_addr), .tv_dval(TV_DValid), .tv_x(xx),
    .tv_y(yy), .data_in(wr_data), .mtl_on(1'b1), .addr_lin(tv_addr_lin), .data_out(tv_data), .dval(tv_data_en));  // open: test
  assign wr_data[7:0] = {8{1'b0}};  // WIRE inst65
  or inst69 (buf_en, y1_new_pix, buf_wr);
  cnt_div inst110 (.clock(clk_50), .q(clk_div_50));
  cnt_div inst111 (.clock(clk_av), .q(clk_div_27));
  DIV_COUNT inst41 (.clock(mtl_y[7]), .q(div_clk));
  DIV_COUNT inst113 (.clock(TV_Field), .q(div_fiel));
  DFF inst84 (.CLK(clk_av), .D(inst53_end_line), .Q(line_end));  // open: CLRN, PRN
  shift_11x720 inst2 (
    .clk(clk_blob), .sr_in_1(tv_mask2), .sr_in_0(buf_wr_data), .sel(TV_Y_one), .shift(buf_en),
    .sr_out_720(buf_data));
  RAM_Label inst66 (
    .data_a(ram1w_data), .address_a(ram1w_addr), .wren_a(ram1_en), .data_b(ram2w_data),
    .address_b(ram2w_addr), .wren_b(ram2_en), .clock(clk_blob), .q_a(ram1_data), .q_b(ram2_data));
  MUX_ADDR inst82 (
    .data1x({bl1_data, bl1_addr, bl1_wr_en}), .data0x({bl0_data, bl0_addr, bl0_wr_en}), .sel(mux_sel),
    .result({ram1w_data, ram1w_addr, ram1_en}));
  MUX_ADDR inst91 (
    .data1x({bl2_data, bl2_addr, bl2_wr_en}), .data0x({bl3_data, bl3_addr, bl3_en}), .sel(mux_sel),
    .result({ram2w_data, ram2w_addr, ram2_en}));
  RAM_Merge inst75 (
    .data_a(label_wr_data), .address_a(labl_addr), .wren_a(labl_wr), .data_b({22{1'b0}}),
    .address_b(r_labl_addr), .wren_b(1'b0), .clock(clk_blob), .q_b(label_data));  // open: q_a
  RAM_BOX inst86 (
    .data_a(ram_bl_data), .address_a(ram_bl_addr), .wren_a(ram_bl), .data_b({gg, {32{1'b0}}}),
    .address_b(hps_addr), .wren_b(1'b0), .clock(clk_blob), .q_b(hps_data));  // open: q_a
  or inst135 (inst135_out, key_up, key_down);
  FISH_CALIB #(.five(4'b0101), .ten(4'b1010), .f_teen(4'b1111)) inst36 (
    .clk(MTL2_DCLK), .case1(five_en), .case2(ten_en), .case3(f_teen_en), .fish_cal(fish_cal[3:0]));
  cnt_cal inst35 (.sset(reset), .updown(key_up), .clock(clk_div_50[22]), .cnt_en(inst135_out));  // open: q
  or inst32 (inst32_out, appl_en, play_en);
  not inst143 (inst143_out, DLY2);
  and inst141 (inst141_out, hps_req, inst32_out);
  imp_one_clk inst88 (.IN(clk_av), .CLK(clk_blob), .EN(1'b1), .OUT(inst88_out));
  SEG7_LUT_6 inst101 (
    .iDIG({{20{1'b0}}, fish_cal[3:0]}), .oSEG0(HEX0), .oSEG1(HEX1), .oSEG2(HEX2), .oSEG3(HEX3), .oSEG4(HEX4),
    .oSEG5(HEX5));
  or inst139 (inst139_out, reset_buf, frame_stop);
  or inst138 (inst138_out, reset_buf, frame_stop);
  or inst56 (reset_buf, inst143_out, fifo_err, 1'b0);
  FIFO_IN_DATA inst54 (
    .data(tv_data), .wrreq(tv_data_en), .wrclk(clk_av), .rdreq(fifo_wr_req), .rdclk(clk_sdram),
    .aclr(inst139_out), .q(fifo_wr_data), .rdfull(fifo_wr_full), .rdusedw(fifo_wr_use));
  FIFO_IN_ADDR inst55 (
    .data(tv_addr_lin[19:0]), .wrreq(tv_data_en), .wrclk(clk_av), .rdreq(fifo_wr_req), .rdclk(clk_sdram),
    .aclr(inst138_out), .q(fifo_wr_addr));
  not inst175 (inst175_out, res);
  DFF inst99[7:0] (.CLK(clk_blob), .D(hps_addr), .Q(inst99_q));  // open: CLRN, PRN
  or inst105 (inst105_out, clear_on, sw[5]);
  lpm_counter03764 inst17760 (.clock(clk1_50), .clk_en(inst175_out), .q(inst17760_q));
  BOX_DRAW_1 #(.size(10)) inst87 (
    .clk(clk_blob), .reset(res_box_graw), .new_pix(inst88_out), .xy(ram_bl_data[39:0]),
    .bl_addr(ram_bl_addr), .bl_en(ram_bl), .x(xx), .y(tv_y), .bl_cnt(box_cnt), .pix_draw(pix_draw));
  final_keys_2 inst59 (
    .clk1_50(clk1_50), .clk_vga(MTL2_DCLK), .oReady(tr1), .touch_count(touch_rc), .touch_identif(torg),
    .touch_x(touch_x1), .touch_y(touch_y1), .en(1'b1), .mtl_x(mtl_x), .mtl_y(mtl_y), .vv({24{1'b1}}),
    .gg({32{1'b0}}), .iRGB_a({ir_a, ig_a, ib_a}), .out_RGB({ir, ig, ib}), .play_en(play_en),
    .five_en(five_en), .ten_en(ten_en), .f_teen_en(f_teen_en), .twfi_en(twfi_en), .fiei_en(fiei_en),
    .eion_en(eion_en), .clear_on(clear_on), .ti_count(ti_count), .ti_sr_mass(ti_sr_mass),
    .ti_com_mass(ti_com_mass), .tl_count(tl_count), .tl_sr_mass(tl_sr_mass), .tl_com_mass(tl_com_mass));
  num_x inst146 (.result(inst146_result));
  num_y inst149 (.result(inst149_result));
  or inst74 (inst74_out, fifo_rd_err, fifo_wr_full);
  n_pix_frame_288 inst142 (.result(inst142_result));
  test_in inst120 (.result(inst120_result));
  not inst176 (inst176_out, MTL2_TOUCH_INT_n);
  ghrd_top inst124 (
    .CLOCK(clk_blob), .HPS_DDR3_RZQ(HPS_DDR3_RZQ), .HPS_ENET_RX_CLK(HPS_ENET_RX_CLK),
    .HPS_ENET_RX_DATA(HPS_ENET_RX_DATA), .HPS_ENET_RX_DV(HPS_ENET_RX_DV), .HPS_SPIM_MISO(HPS_SPIM_MISO),
    .HPS_UART_RX(HPS_UART_RX), .HPS_USB_CLKOUT(HPS_USB_CLKOUT), .HPS_USB_DIR(HPS_USB_DIR),
    .HPS_USB_NXT(HPS_USB_NXT), .box_req(inst141_out), .box_n(box_cnt), .box_addr(inst99_q),
    .box_x0({{6{1'b0}}, hps_data[9:0]}), .box_xn({{6{1'b0}}, hps_data[29:20]}),
    .box_y0({{6{1'b0}}, hps_data[19:10]}), .box_yn({{6{1'b0}}, hps_data[39:30]}),
    .n_pix({{13{1'b0}}, hps_data[58:40]}), .SW({10{1'b0}}), .x_min({{6{1'b0}}, xo_min}),
    .x_max({{6{1'b0}}, xn_max}), .n_fraame({{28{1'b0}}, fish_cal[3:0]}), .reset_cnt(inst105_out),
    .sw_mass(sw_mass_out), .test_cnt_balls(sw[6]), .HPS_DDR3_ADDR(HPS_DDR3_ADDR), .HPS_DDR3_BA(HPS_DDR3_BA),
    .HPS_DDR3_CAS_N(HPS_DDR3_CAS_N), .HPS_DDR3_CKE(HPS_DDR3_CKE), .HPS_DDR3_CK_N(HPS_DDR3_CK_N),
    .HPS_DDR3_CK_P(HPS_DDR3_CK_P), .HPS_DDR3_CS_N(HPS_DDR3_CS_N), .HPS_DDR3_DM(HPS_DDR3_DM),
    .HPS_DDR3_ODT(HPS_DDR3_ODT), .HPS_DDR3_RAS_N(HPS_DDR3_RAS_N), .HPS_DDR3_RESET_N(HPS_DDR3_RESET_N),
    .HPS_DDR3_WE_N(HPS_DDR3_WE_N), .HPS_ENET_GTX_CLK(HPS_ENET_GTX_CLK), .HPS_ENET_MDC(HPS_ENET_MDC),
    .HPS_ENET_TX_DATA(HPS_ENET_TX_DATA), .HPS_ENET_TX_EN(HPS_ENET_TX_EN), .HPS_FLASH_DCLK(HPS_FLASH_DCLK),
    .HPS_FLASH_NCSO(HPS_FLASH_NCSO), .HPS_SD_CLK(HPS_SD_CLK), .HPS_SPIM_CLK(HPS_SPIM_CLK),
    .HPS_SPIM_MOSI(HPS_SPIM_MOSI), .HPS_UART_TX(HPS_UART_TX), .HPS_USB_STP(HPS_USB_STP), .LEDR(inst124_ledr),
    .n_fish(fish_cnt), .req_res(hps_req_res), .addr_out(hps_addr), .test_32t_0(fish_area),
    .test_16t_0(fish_len), .con_yark(con_yark), .HPS_CONV_USB_N(HPS_CONV_USB_N), .HPS_DDR3_DQ(HPS_DDR3_DQ),
    .HPS_DDR3_DQS_N(HPS_DDR3_DQS_N), .HPS_DDR3_DQS_P(HPS_DDR3_DQS_P), .HPS_ENET_INT_N(HPS_ENET_INT_N),
    .HPS_ENET_MDIO(HPS_ENET_MDIO), .HPS_FLASH_DATA(HPS_FLASH_DATA), .HPS_GPIO(HPS_GPIO),
    .HPS_GSENSOR_INT(HPS_GSENSOR_INT), .HPS_I2C1_SCLK(HPS_I2C1_SCLK), .HPS_I2C1_SDAT(HPS_I2C1_SDAT),
    .HPS_I2C2_SCLK(HPS_I2C2_SCLK), .HPS_I2C2_SDAT(HPS_I2C2_SDAT), .HPS_I2C_CONTROL(HPS_I2C_CONTROL),
    .HPS_KEY(HPS_KEY), .HPS_LED(HPS_LED), .HPS_SD_CMD(HPS_SD_CMD), .HPS_SD_DATA(HPS_SD_DATA),
    .HPS_SPIM_SS(HPS_SPIM_SS), .HPS_USB_DATA(HPS_USB_DATA));  // open: x1_0, x2_0, y1_0, y2_0, del_x, del_y
  lpm_compare0634634 inst17651 (.dataa(inst17760_q), .aeb(res));
  Touch inst1734 (
    .T_iCLK(clk1_50), .T_iRSTN(res), .T_iTRIG(inst176_out), .T_oREADY(tr1), .T_oREG_X1(tor_x1),
    .T_oREG_Y1(tor_y1), .T_oREG_X2(tor_x2), .T_oREG_Y2(tor_y2), .T_oREG_TOUCH_COUNT(tortc),
    .T_oREG_GESTURE(torg), .T_I2C_SCLK(MTL2_TOUCH_I2C_SCL), .T_I2C_SDAT(MTL2_TOUCH_I2C_SDA));
  mux_vga inst118 (
    .data1x(24'b111111110000000000000000), .data0x(24'b000000001111111100000000), .sel(num_count),
    .result(color_num));
  DFF inst67 (.CLK(clk_sdram), .D(inst74_out), .Q(fifo_err));  // open: CLRN, PRN
  num_for_count inst59997 (
    .clk(MTL2_DCLK), .reset(vga_reset), .vga_x(mtl_x), .vga_y(mtl_y), .data(fish_cnt), .x_in(inst146_result),
    .y(inst149_result), .out_mux_vga(num_count));
  comp_fish inst157 (.dataa(fish_cnt), .datab({{12{1'b0}}, fish_cal[3:0]}), .alb(inst157_alb));
  COMP_USE inst79 (.dataa(rd_use), .ageb(inst79_ageb));
  FRAME_BUFFER inst60 (
    .clk(clk_sdram), .reset(reset_buf), .sd_wait_rq(sd_wait_rq), .wr_data(fifo_wr_data),
    .wr_addr(fifo_wr_addr), .wr_use(fifo_wr_use), .rd_use(fifo_rd_use), .n_pix_frame(inst142_result),
    .test_in(inst120_result), .sd_addr(sd_dddr), .sd_byte_en_n(sd_byte_en), .sd_data(sd_data),
    .sd_read_n(sd_read), .sd_write_n(sd_write), .wr_ack(fifo_wr_req));  // open: state_out, page_rd_out, test
  and inst169 (inst169_out, num_calib, clk_div_50[24], inst157_alb);
  mux_vga inst115 (.data1x(color_num), .data0x(mux_bl_ti), .sel(mux_vgas), .result({ir_a, ig_a, ib_a}));
  or inst14654225 (mux_vgas, num_count, sr_mass, com_mass, inst169_out);
  FIFO_OUT_DATA inst58 (
    .data(sdram_data), .wrreq(sdram_data_valid), .wrclk(clk_sdram), .rdreq(data_ack), .rdclk(MTL2_DCLK),
    .aclr(reset_buf), .wrfull(inst58_wrfull), .wrempty(inst58_wrempty), .wrusedw(fifo_rd_use), .q(VGA_YCbCr),
    .rdusedw(rd_use));
  SRFF inst19 (.CLRN(inst78_out), .S(inst79_ageb), .R(1'b0), .CLK(MTL2_DCLK), .Q(vga_reset_n));  // open: PRN
  not inst78 (inst78_out, reset_buf);
  num_x3 inst22291 (.result(inst22291_result));
  num_y inst133350 (.result(inst133350_result));
  num_x2 inst11174 (.result(inst11174_result));
  not inst174 (ready, tr1);
  constant_cal inst128 (.result(inst128_result));
  constant_cal_y inst129 (.result(inst129_result));
  and inst20 (data_ack, vga_data_ack, vga_reset_n);
  or inst76 (fifo_rd_err, inst58_wrfull, 1'b0);
  not inst77 (vga_reset, vga_reset_n);
  imp_one_clk inst16543 (.IN(ready), .CLK(clk1_50), .EN(1'b1), .OUT(ready_touch));
  FRAMEBOX #(.x1(11'b00000000000), .x2(11'b01011010000), .y1(10'b0000000000), .y2(10'b0001100100), .y3(10'b0110000110), .y4(10'b0111100000)) inst50 (
    .clk(MTL2_DCLK), .gr_x(mtl_x), .gr_y(mtl_y), .outbl(inst50_outbl));
  sr_mass inst1093346 (
    .clk(MTL2_DCLK), .reset(vga_reset), .vga_x(mtl_x), .vga_y(mtl_y), .data(fish_len[9:0]),
    .x_in(inst11174_result), .y(inst133350_result), .out_mux_vga(sr_mass), .sr_mass_num(sr_mass_num));
  num_vga inst188819 (
    .clk(MTL2_DCLK), .reset(vga_reset), .vga_x(mtl_x), .vga_y(mtl_y), .data(fish_cal), .x(inst128_result),
    .y(inst129_result), .out_mux_vga(num_calib));
  num_for_com_mass_2 inst57 (
    .clk(MTL2_DCLK), .reset(vga_reset), .vga_x(mtl_x), .vga_y(mtl_y), .fish_cnt(fish_cnt),
    .sr_mass(sr_mass_num), .x_in(inst22291_result), .y(inst133350_result), .out_mux_vga(com_mass));
  lpm_mux_24bit inst61 (
    .data1x({24{1'b0}}), .data0x({VGA_YCbCr[15:8], VGA_YCbCr[15:8], VGA_YCbCr[15:8]}), .sel(inst50_outbl),
    .result(mux_black));
  lpm_mux_24bit inst133 (
    .data1x({tl_count, tl_count, tl_count}), .data0x(mux_black), .sel(ti_count), .result(inst133_result));
  MTL_VGA_SYNC inst126 (
    .clk(MTL2_DCLK), .reset(vga_reset), .iR(ir), .iG(ig), .iB(ib), .en(mtl_on), .cnt_x(mtl_x), .cnt_y(mtl_y),
    .Hsync(inst126_hsync), .Vsync(inst126_vsync), .R(MTL2_R), .G(MTL2_G), .B(MTL2_B), .data_ack(vga_ack_2));  // open: test
  YUV422_to_444 inst21 (
    .iYCbCr(VGA_YCbCr), .iX(mtl_x[9:0]), .iCLK(MTL2_DCLK), .iRST_N(vga_reset_n), .oY(inst21_oy),
    .oCb(inst21_ocb), .oCr(inst21_ocr));
  lpm_mux_1bit inst103 (.data1(vga_ack_2), .data0(vga_ack_1), .sel(mtl_on), .result(vga_data_ack));
  DFF inst151 (.CLK(MTL2_DCLK), .D(1'b1), .Q(inst151_q));  // open: CLRN, PRN
  DFFE inst16573[28:0] (
    .D({tor_x1, tor_y1, torg, tortc}), .CLK(clk_50), .ENA(ready_touch),
    .Q({touch_x1, touch_y1, touch_rg, touch_rc}));  // open: PRN, CLRN
  SW_MASS inst108 (.clk(MTL2_DCLK), .twfi(twfi_en), .fiei(fiei_en), .eion(eion_en), .sw_mass_out(sw_mass_out));
  GLOBAL inst51 (.IN(clk_143), .OUT(clk_sdram));
  GLOBAL inst52 (.IN(clk_143d), .OUT(DRAM_CLK));
  DFF inst152 (.CLK(MTL2_DCLK), .D(inst151_q), .Q(inst152_q));  // open: CLRN, PRN
  not inst102 (inst102_out, mtl_on);
  lpm_compare246346 inst17362 (.dataa({{19{1'b0}}, tor_x2, tor_y2, tortc, {8{1'b0}}}), .aeb(aeqb));
  lpm_mux_24bit inst136 (
    .data1x({tl_sr_mass, tl_sr_mass, tl_sr_mass}), .data0x(inst133_result), .sel(ti_sr_mass),
    .result(inst136_result));
  not inst159 (MTL2_HSD, inst126_hsync);
  DFF inst154 (.CLK(MTL2_DCLK), .D(inst152_q), .Q(inst154_q));  // open: CLRN, PRN
  not inst134 (MTL2_VSD, inst126_vsync);
  DFF inst155 (.CLK(MTL2_DCLK), .D(inst154_q), .Q(inst155_q));  // open: CLRN, PRN
  YCbCr2RGB inst23 (
    .iY(inst21_oy), .iCb(inst21_ocb), .iCr(inst21_ocr), .iDVAL(1'b0), .iRESET(vga_reset), .iCLK(MTL2_DCLK),
    .Red(red), .Green(green), .Blue(blue));  // open: oDVAL
  qSDRAM_100MHz inst42 (
    .clk_clk(clk_sdram), .reset_reset_n(reset_n), .m_address(sd_dddr), .m_byteenable_n(sd_byte_en),
    .m_chipselect(1'b0), .m_writedata(sd_data), .m_read_n(sd_read), .m_write_n(sd_write),
    .m_readdata(sdram_data), .m_readdatavalid(sdram_data_valid), .m_waitrequest(sd_wait_rq),
    .ram_addr(DRAM_ADDR), .ram_ba(DRAM_BA), .ram_cas_n(DRAM_CAS_N), .ram_cke(DRAM_CKE), .ram_cs_n(DRAM_CS_N),
    .ram_dqm({DRAM_UDQM, DRAM_LDQM}), .ram_ras_n(DRAM_RAS_N), .ram_we_n(DRAM_WE_N), .ram_dq(DRAM_DQ));
  VGA_SYNC_2 inst33 (
    .clk(MTL2_DCLK), .reset(vga_reset), .iR(ir), .iG(ig), .iB(ib), .en(inst102_out), .cnt_x(vga_x),
    .cnt_y(vga_y), .Hsync(hsync), .Vsync(vsync), .DE(VGA_BLANK_N), .R(VGA_R), .G(VGA_G), .B(VGA_B),
    .data_ack(vga_ack_1));  // open: test
  xor inst153 (reset_av, inst151_q, inst155_q);
  lpm_mux_24bit inst140 (
    .data1x({tl_com_mass, tl_com_mass, tl_com_mass}), .data0x(inst136_result), .sel(ti_com_mass),
    .result(mux_bl_ti));
  assign VGA_CLK = MTL2_DCLK;  // WIRE inst160
  not inst90 (VGA_HS, hsync);
  not inst95 (VGA_VS, vsync);

  // Other names for the same wires on the sheet: blank_vga = VGA_BLANK_N; clk_sdram_chip = DRAM_CLK;
  //   clk_vga = MTL2_DCLK; DRAM_DQM[1:0] = {DRAM_UDQM, DRAM_LDQM}

  // Notes on the sheet:
  //   TOUCH
  //   SW
  //   CLOCK
  //   SW[0] - mask on
  //   VGA FISH COUNT
  //   LEDS
  //   FISH COUNT SEG
  //   FISH CALIBRATION SEG
  //   KEYS
  //   SDRAM
  //   one
  //   zero
  //   reset_av
  //   I2C
  //   VGA
  //   FRAME BUFFER
  //   AV
  //   MASK
  //   BLOB_ANALYSIS
  //   BOX_DRAW
  //   BOX_DRAW
endmodule
